# EAGLE schematic EMM (EAGLE 6.3)
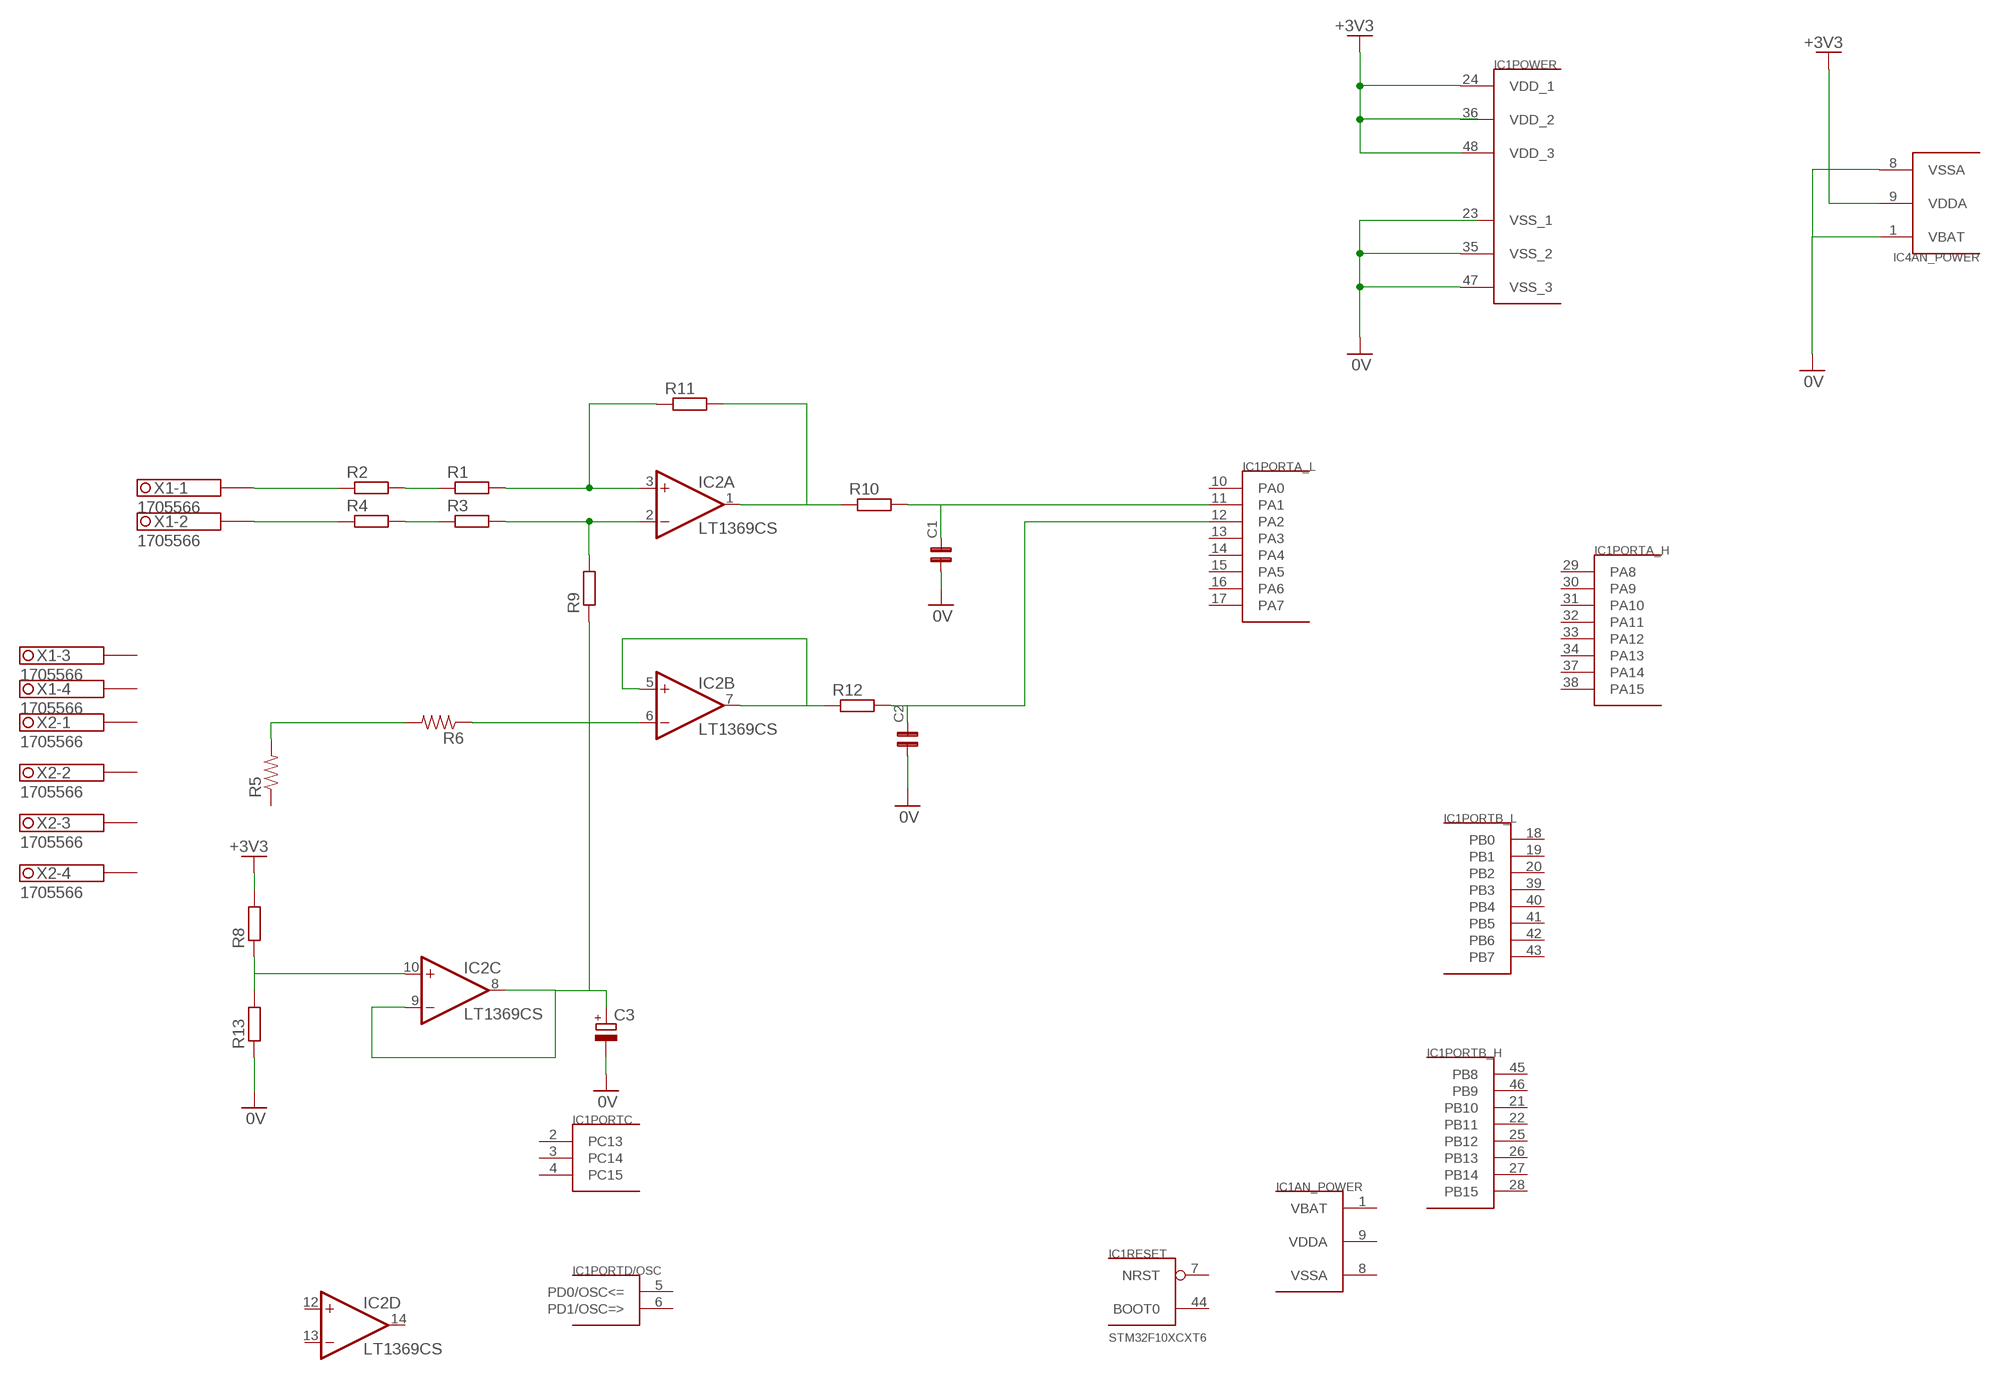
[diagram p0: schematic, sheet 1]

## Parts
C1  C0805  [0805]
C2  C0805  [0805]
C3  CPOL-EUCT6032  [CT6032]
IC1  STM32F10XCXT6  [TQFP48]
IC2  LT1369CS  [SO14]
IC4  STM32F10XCXT6  [TQFP48]
R1  R-EU_0207/10  [0207/10]
R2  R-EU_0207/10  [0207/10]
R3  R-EU_0207/10  [0207/10]
R4  R-EU_0207/10  [0207/10]
R5  RESISTOR  [0805]
R6  RESISTOR  [0805]
R8  R-EU_R0805  [R0805]
R9  R-EU_M0805  [M0805]
R10  R-EU_R0805  [R0805]
R11  R-EU_M0805  [M0805]
R12  R-EU_R0805  [R0805]
R13  R-EU_R0805  [R0805]
X1  1705566  [1705566]
X2  1705566  [1705566]

## Nets
0V: C1.1 C2.1 C3.- IC1.35(POWER:VSS_2) IC1.47(POWER:VSS_3) IC4.1(AN_POWER:VBAT) IC4.8(AN_POWER:VSSA) R13.1
+3V3: IC1.24(POWER:VDD_1) IC1.48(POWER:VDD_3) IC4.9(AN_POWER:VDDA) R8.2
N$1: IC2.1(A:OUT) R10.1 R11.2
N$2: IC2.3(A:+IN) R1.2 R11.1
N$3: IC2.2(A:-IN) R3.2 R9.2
N$4: IC2.5(B:+IN) IC2.7(B:OUT) R12.1
N$5: R2.1 X1.1.2(-1:1B)
N$6: R5.2 R6.2
N$7: IC2.6(B:-IN) R6.1
N$8: R1.1 R2.2
N$9: R4.1 X1.2.2(-2:1B)
N$10: R3.1 R4.2
N$11: C1.2 IC1.11(PORTA_L:PA1) R10.2
N$12: C2.2 IC1.12(PORTA_L:PA2) R12.2
N$13: IC2.10(C:+IN) R8.1 R13.2
N$14: C3.+ IC2.8(C:OUT) IC2.9(C:-IN) R9.1
Unconnected: IC1.2(PORTC:PC13) IC1.3(PORTC:PC14) IC1.4(PORTC:PC15) IC1.5(PORTD/OSC:PD0/OSC<=) IC1.6(PORTD/OSC:PD1/OSC=>) IC1.7(RESET:NRST) IC1.10(PORTA_L:PA0) IC1.13(PORTA_L:PA3) IC1.14(PORTA_L:PA4) IC1.15(PORTA_L:PA5) IC1.16(PORTA_L:PA6) IC1.17(PORTA_L:PA7) IC1.18(PORTB_L:PB0) IC1.19(PORTB_L:PB1) IC1.20(PORTB_L:PB2) IC1.21(PORTB_H:PB10) IC1.22(PORTB_H:PB11) IC1.25(PORTB_H:PB12) IC1.26(PORTB_H:PB13) IC1.27(PORTB_H:PB14) IC1.28(PORTB_H:PB15) IC1.29(PORTA_H:PA8) IC1.30(PORTA_H:PA9) IC1.31(PORTA_H:PA10) IC1.32(PORTA_H:PA11) IC1.33(PORTA_H:PA12) IC1.34(PORTA_H:PA13) IC1.37(PORTA_H:PA14) IC1.38(PORTA_H:PA15) IC1.39(PORTB_L:PB3) IC1.40(PORTB_L:PB4) IC1.41(PORTB_L:PB5) IC1.42(PORTB_L:PB6) IC1.43(PORTB_L:PB7) IC1.44(RESET:BOOT0) IC1.45(PORTB_H:PB8) IC1.46(PORTB_H:PB9) IC2.12(D:+IN) IC2.13(D:-IN) IC2.14(D:OUT) IC4.2(PORTC:PC13) IC4.3(PORTC:PC14) IC4.4(PORTC:PC15) IC4.5(PORTD/OSC:PD0/OSC<=) IC4.6(PORTD/OSC:PD1/OSC=>) IC4.7(RESET:NRST) IC4.10(PORTA_L:PA0) IC4.11(PORTA_L:PA1) IC4.12(PORTA_L:PA2) IC4.13(PORTA_L:PA3) IC4.14(PORTA_L:PA4) IC4.15(PORTA_L:PA5) IC4.16(PORTA_L:PA6) IC4.17(PORTA_L:PA7) IC4.18(PORTB_L:PB0) IC4.19(PORTB_L:PB1) IC4.20(PORTB_L:PB2) IC4.21(PORTB_H:PB10) IC4.22(PORTB_H:PB11) IC4.25(PORTB_H:PB12) IC4.26(PORTB_H:PB13) IC4.27(PORTB_H:PB14) IC4.28(PORTB_H:PB15) IC4.29(PORTA_H:PA8) IC4.30(PORTA_H:PA9) IC4.31(PORTA_H:PA10) IC4.32(PORTA_H:PA11) IC4.33(PORTA_H:PA12) IC4.34(PORTA_H:PA13) IC4.37(PORTA_H:PA14) IC4.38(PORTA_H:PA15) IC4.39(PORTB_L:PB3) IC4.40(PORTB_L:PB4) IC4.41(PORTB_L:PB5) IC4.42(PORTB_L:PB6) IC4.43(PORTB_L:PB7) IC4.44(RESET:BOOT0) IC4.45(PORTB_H:PB8) IC4.46(PORTB_H:PB9) R5.1 X1.1.1(-1:1A) X1.2.1(-2:1A) X1.3.1(-3:1A) X1.3.2(-3:1B) X1.4.1(-4:1A) X1.4.2(-4:1B) X2.1.1(-1:1A) X2.1.2(-1:1B) X2.2.1(-2:1A) X2.2.2(-2:1B) X2.3.1(-3:1A) X2.3.2(-3:1B) X2.4.1(-4:1A) X2.4.2(-4:1B)

## Power pins joined to a net without a drawn wire
VBAT: IC1.1(AN_POWER:VBAT)
VDD: IC2.4(P:VDD)
VDD_1: IC4.24(POWER:VDD_1)
VDD_2: IC1.36(POWER:VDD_2) IC4.36(POWER:VDD_2)
VDD_3: IC4.48(POWER:VDD_3)
VDDA: IC1.9(AN_POWER:VDDA)
VEE: IC2.11(P:VEE)
VSS_1: IC1.23(POWER:VSS_1) IC4.23(POWER:VSS_1)
VSS_2: IC4.35(POWER:VSS_2)
VSS_3: IC4.47(POWER:VSS_3)
VSSA: IC1.8(AN_POWER:VSSA)

## Library data of the parts
C1 C2 = capsmd:C0805
C3 = resistor:CPOL-EU: POLARIZED CAPACITOR, European symbol
IC1 IC4 = stm32:STM32F10XCXT6: ST STM32F101/103 48pin LQFP
IC2 = linear-technology-3:LT1369*: Quad Precision Rail-to-Rail Input and Output Op Amps
R1-R4 R8-R13 = resistor:R-EU_: RESISTOR, European symbol
R5 R6 = SparkFun:RESISTOR: Resistor Basic schematic elements and footprints for 0603, 1206, and PTH 1/10th watt (small) resistors.
X1 X2 = con-phoenix-3.81:1705566: MKDSD 1,5/ 4-3,81 Printklemme Nennstrom: 8 A Bemessungsspannung: 200 V Raster: 3,81 mm Polzahl: 4 Montageart: Löten Anschlussart: Schraubanschluss Anschlussrichtung vom Leiter zur Platine: 0° Source: http://eshop.phoenixcontact.com .. 1705566.pdf